# Altium schematic sheet 1-power.SchDoc
size B
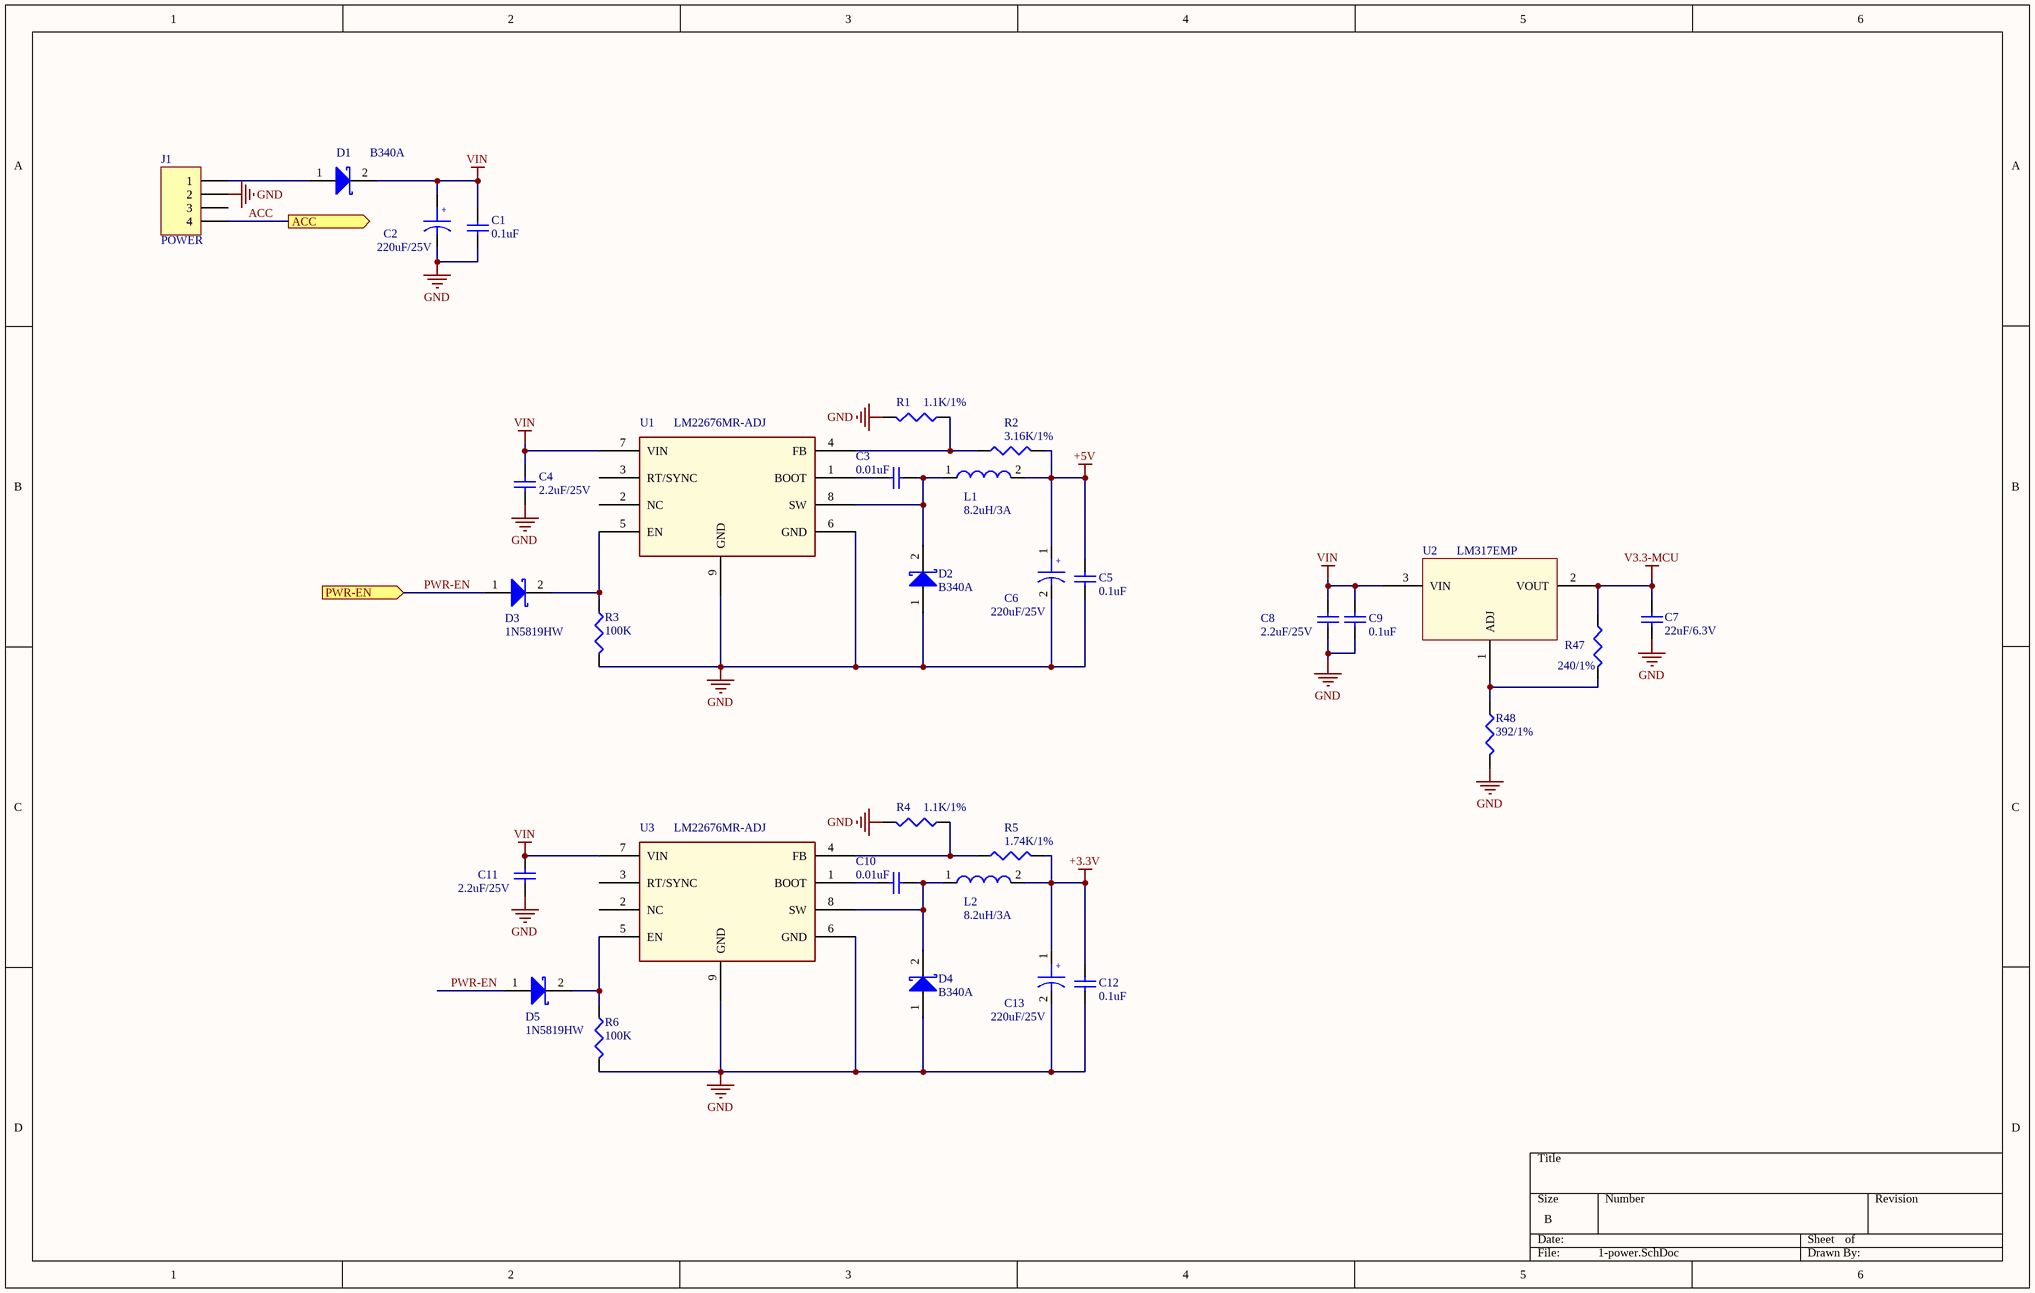
[diagram p0: 1-power.SchDoc]

## Parts
C1  0.1uF  [0603]
C2  220uF/25V  [DL-8*10.5]
C3  0.01uF  [0603]
C4  2.2uF/25V  [1210]
C5  0.1uF  [0603]
C6  220uF/25V  [DL-8*10.5]
C7  22uF/6.3V  [1206]
C8  2.2uF/25V  [1210]
C9  0.1uF  [0603]
C10  0.01uF  [0603]
C11  2.2uF/25V  [1210]
C12  0.1uF  [0603]
C13  220uF/25V  [DL-8*10.5]
D1  B340A  [B320A]
D2  B340A  [B320A]
D3  1N5819HW  [1N5819]
D4  B340A  [B320A]
D5  1N5819HW  [1N5819]
J1  POWER  [3030WV-F-2*2P]
L1  8.2uH/3A  [IND_8.2UH_3A]
L2  8.2uH/3A  [IND_8.2UH_3A]
R1  1.1K/1%  [0603]
R2  3.16K/1%  [0603]
R3  100K  [0603]
R4  1.1K/1%  [0603]
R5  1.74K/1%  [0603]
R6  100K  [0603]
R47  240/1%  [0603]
R48  392/1%  [0603]
U1  LM22676MR-ADJ  [PSO8]
U2  LM317EMP  [SOT-223]
U3  LM22676MR-ADJ  [PSO8]

## Ports
ACC (out), PWR-EN (in)

## Nets
+3.3V: C12.2 C13.1 L2.2 R5.2
+5V: C5.2 C6.1 L1.2 R2.2
GND: C1.1 C2.2 C4.1 C5.1 C6.2 C7.1 C8.1 C9.2 C11.1 C12.1 C13.2 D2.1(A) D4.1(A) J1.2 R1.2 R3.2 R4.2 R6.2 R48.2 U1.6(GND) U1.9(GND) U3.6(GND) U3.9(GND)
V3.3-MCU: C7.2 R47.1 U2.2(VOUT)
VIN: C1.2 C2.1 C4.2 C8.2 C9.1 C11.2 D1.2(K) U1.7(VIN) U2.3(VIN) U3.7(VIN)
ACC: J1.4 ; port ACC
PWR-EN: D3.1(A) D5.1(A) ; port PWR-EN
NetC3_1: C3.1 D2.2(K) L1.1 U1.8(SW)
NetC3_2: C3.2 U1.1(BOOT)
NetC10_1: C10.1 D4.2(K) L2.1 U3.8(SW)
NetC10_2: C10.2 U3.1(BOOT)
NetD1_1: D1.1(A) J1.1
NetD3_2: D3.2(K) R3.1 U1.5(EN)
NetD5_2: D5.2(K) R6.1 U3.5(EN)
NetR1_1: R1.1 R2.1 U1.4(FB)
NetR4_1: R4.1 R5.1 U3.4(FB)
NetR47_2: R47.2 R48.1 U2.1(ADJ)

Not connected (* = marked no-connect by the designer): J1 3; U1 2(NC) 3(RT/SYNC); U3 2(NC) 3(RT/SYNC)

## Notes on the sheet
- (in symbol CAP WP) +

## Library data of the parts
C1 C5 C9 C12 = Cap: Capacitor; Published: 8-Jun-2000; LatestRevisionDate: 17-Jul-2002; LatestRevisionNote: Re-released for DXP Platform.; PackageReference: RAD-0.3; Publisher: Altium Limited; PackageDescription: Radial Cap, Thru-Hole; 2 Leads; 0.3 in Pin Spacing; Value: 0.1uF
C2 C6 C13 = CAP WP
C3 C4 C7 C8 C10 C11 = Cap: Capacitor; Value: 0.1uF; Published: 8-Jun-2000; LatestRevisionDate: 17-Jul-2002; LatestRevisionNote: Re-released for DXP Platform.; PackageReference: RAD-0.3; Publisher: Altium Limited; PackageDescription: Radial Cap, Thru-Hole; 2 Leads; 0.3 in Pin Spacing
D1-D5 = Diode 11DQ03: Schottky Rectifier
J1 = Header 4: Header, 4-Pin; LatestRevisionDate: 17-Jul-2002; LatestRevisionNote: Re-released for DXP Platform.; Publisher: Altium Limited
L1 L2 = 4.7UH_CDH2D09BNP-4R7MC_0.7A_20%: Part Number: SH00000AJ00; ROOM: +1.3V_CORE
R1-R6 R47 R48 = Res3: Resistor; Value: 1K; Published: 8-Jun-2000; LatestRevisionDate: 29-May-2009; LatestRevisionNote: IPC-7351 Footprint Added.; PackageReference: J1-0603; Publisher: Altium Limited; PackageDescription: Chip Resistor
U1 U3 = LM22670_0